# EAGLE schematic EtherMega (EAGLE 5.10)
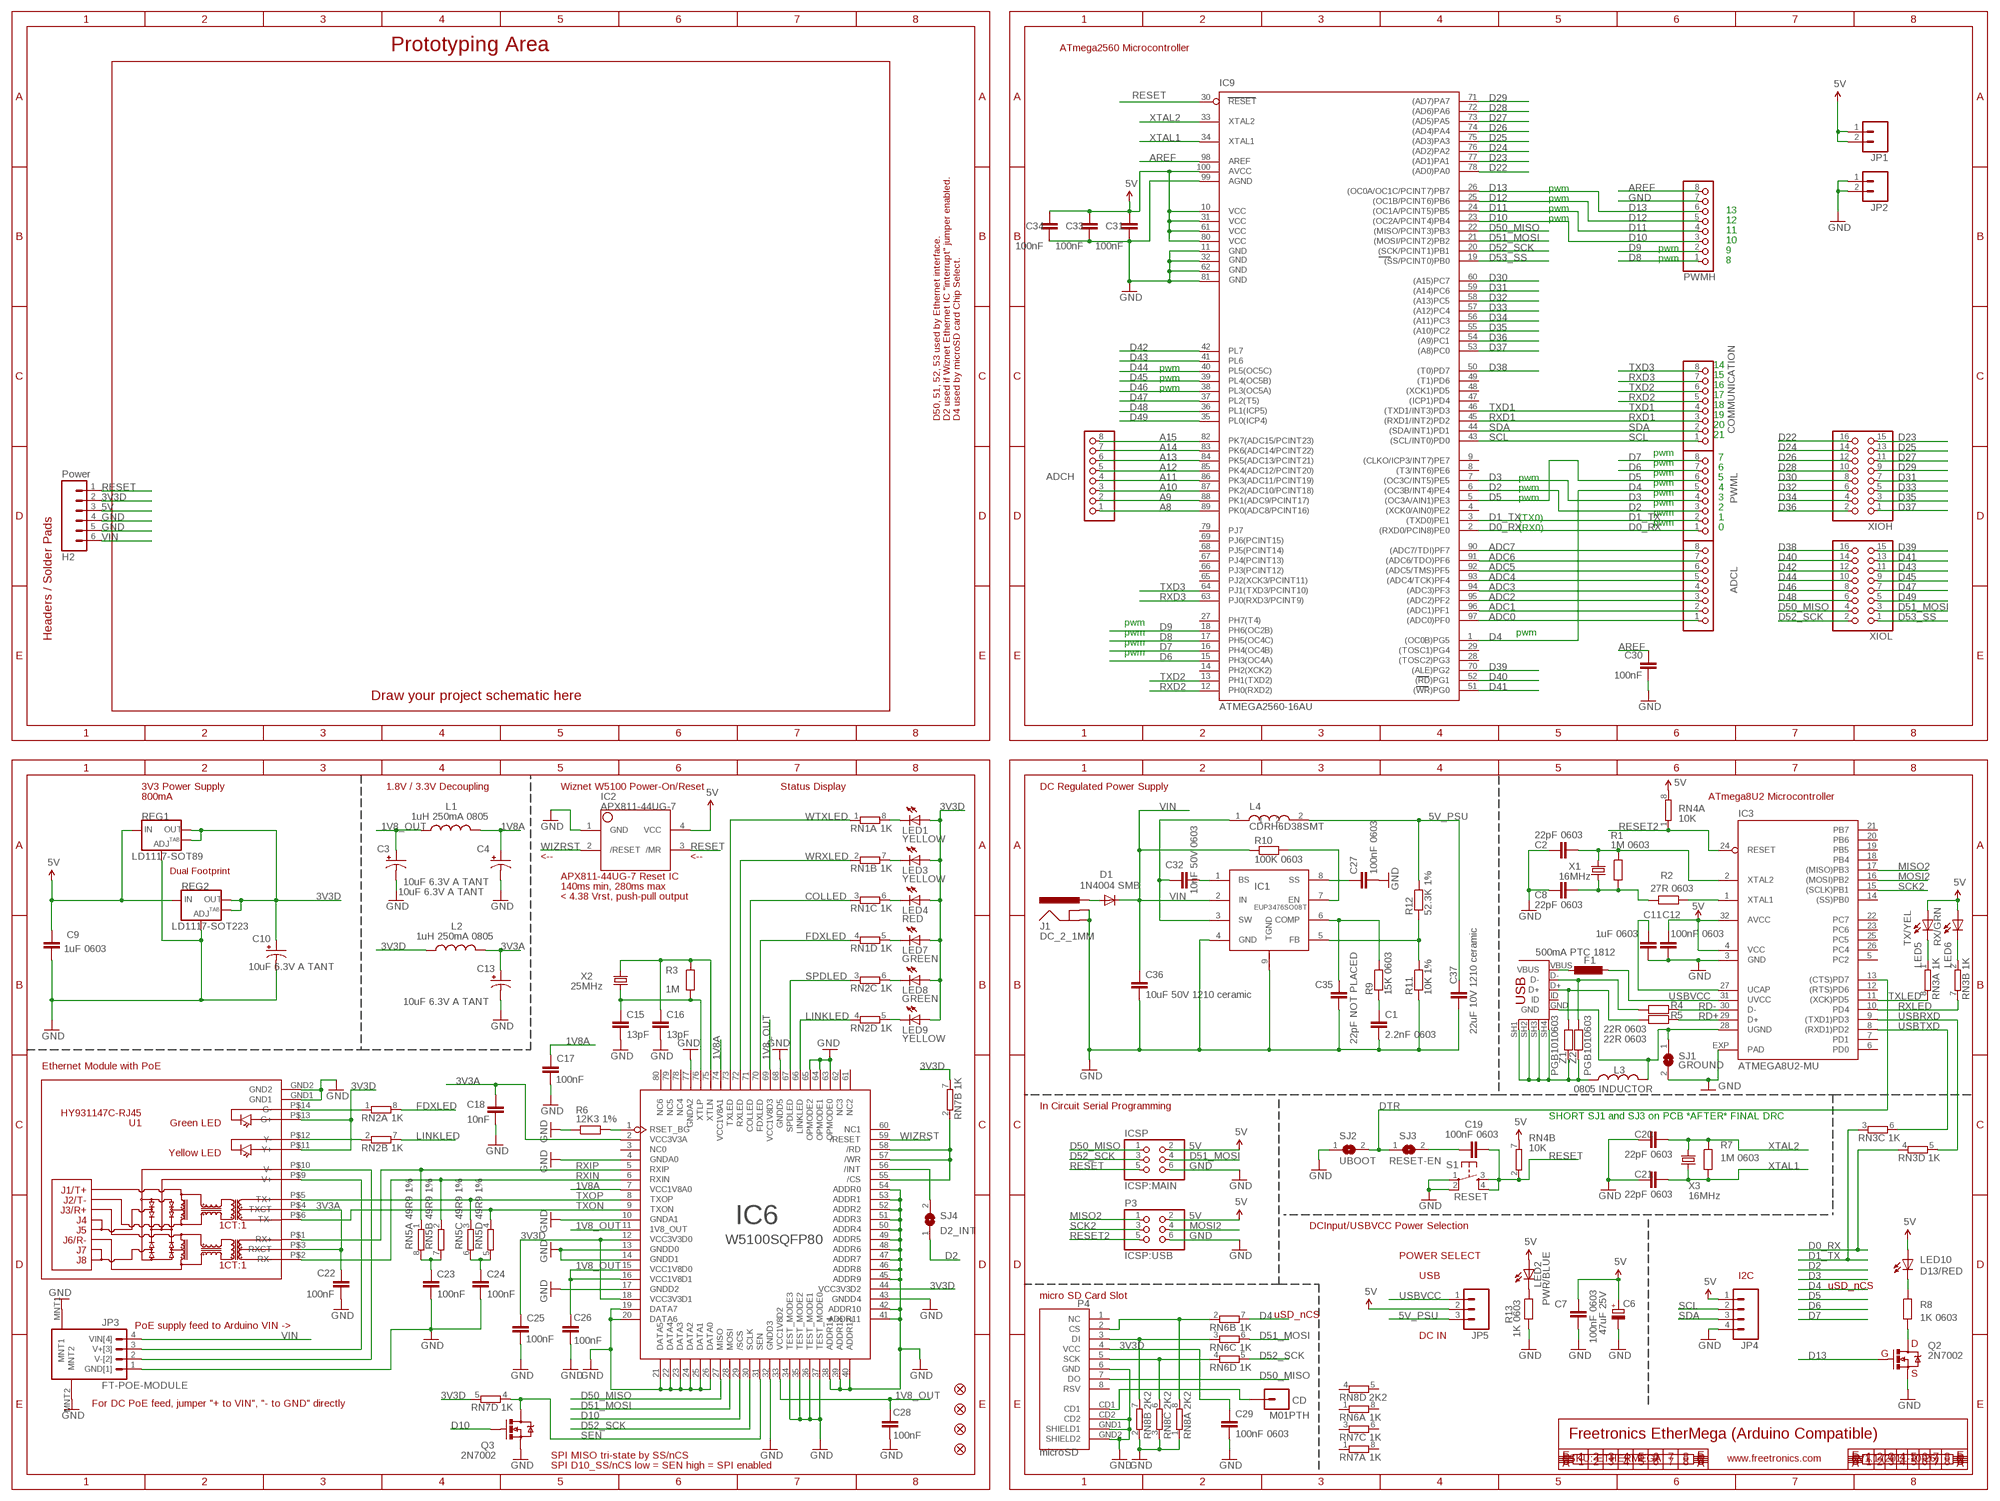
[diagram p0: schematic, sheet 1]

## Parts
ADCH  PINHD-1X8  [1X08]
ADCL  PINHD-1X8  [1X08]
C1  2.2nF 0603  CAP0603  [0603]
C2  22pF 0603  CAP0603  [0603]
C3  10uF 6.3V A TANT  CAP_POL1206  [EIA3216]
C4  10uF 6.3V A TANT  CAP_POL1206  [EIA3216]
C6  47uF 25V  CPOL-EUD  [PANASONIC_D]
C7  100nF 0603  CAP0603  [0603]
C8  22pF 0603  CAP0603  [0603]
C9  1uF 0603  CAP0603  [0603]
C10  10uF 6.3V A TANT  CAP_POL1206  [EIA3216]
C11  1uF 0603  CAP0603  [0603]
C12  100nF 0603  CAP0603  [0603]
C13  10uF 6.3V A TANT  CAP_POL1206  [EIA3216]
C15  13pF  CAP0603  [0603]
C16  13pF  CAP0603  [0603]
C17  100nF  CAP0603  [0603]
C18  10nF  CAP0603  [0603]
C19  100nF 0603  CAP0603  [0603]
C20  22pF 0603  CAP0603  [0603]
C21  22pF 0603  CAP0603  [0603]
C22  100nF  CAP0603  [0603]
C23  100nF  CAP0603  [0603]
C24  100nF  CAP0603  [0603]
C25  100nF  CAP0603  [0603]
C26  100nF  CAP0603  [0603]
C27  100nF 0603  CAP0603  [0603]
C28  100nF  CAP0603  [0603]
C29  100nF 0603  CAP0603  [0603]
C30  100nF  CAP0603  [0603]
C31  100nF  CAP0603  [0603]
C32  10nF 50V 0603  CAP0603  [0603]
C33  100nF  CAP0603  [0603]
C34  100nF  CAP0603  [0603]
C35  22pF NOT PLACED  CAP0603  [0603]
C36  10uF 50V 1210 ceramic  C-EUC1210  [C1210]
C37  22uF 10V 1210 ceramic  C-EUC1210  [C1210]
CD  M01PTH  [1X01]
COMMUNICATION  PINHD-1X8  [1X08]
D1  1N4004 SMB  DIODESMB  [SMB-DIODE]
F1  500mA PTC 1812  L-EUL1812  [L1812]
FID1  FIDUCIAL1X2.5  [FIDUCIAL-1X2.5]
FID2  FIDUCIAL1X2.5  [FIDUCIAL-1X2.5]
FID3  FIDUCIAL1X2.5  [FIDUCIAL-1X2.5]
FID4  FIDUCIAL1X2.5  [FIDUCIAL-1X2.5]
H2  Power  M06SIP  [1X06]
IC1  EUP3476SO08T  [SO08T]
IC2  APX811-44UG-7  APX81X-RESET-IC  [SOT143-R]
IC3  ATMEGA8U2-MU  ATMEL_ATMEGA8U2-MUQFN  [ATMEL_QFN32]
IC6  W5100SQFP80  [SQFP80]
IC9  ATMEGA2560-16AU  ATMEGA1280-16AU  [TQFP100]
ICSP  ICSP:MAIN  PINHD-2X3  [2X03]
J1  DC_2_1MM  POWER_JACKPTH  [POWER_JACK_PTH]
JP1  M02PTH  [1X02]
JP2  M02PTH  [1X02]
JP3  FT-POE-MODULE  FT-POE-MODULE2  [FT-POE-MODULE-CLEAN]
JP4  M04PTH  [1X04]
JP5  M03PTH  [1X03]
L1  1uH 250mA 0805  L-USL2012C  [L2012C]
L2  1uH 250mA 0805  L-USL2012C  [L2012C]
L3  0805 INDUCTOR  INDUCTOR0805-LARGE  [0805-LARGE]
L4  CDRH6D38SMT  [CDRH]
LED1  YELLOW  LED0603  [LED-0603]
LED2  PWR/BLUE  LED0603  [LED-0603]
LED3  YELLOW  LED0603  [LED-0603]
LED4  RED  LED0603  [LED-0603]
LED5  TX/YEL  LED0603  [LED-0603]
LED6  RX/GRN  LED0603  [LED-0603]
LED7  GREEN  LED0603  [LED-0603]
LED8  GREEN  LED0603  [LED-0603]
LED9  YELLOW  LED0603  [LED-0603]
LED10  D13/RED  LED0603  [LED-0603]
P1  USB-FT  [USB-MINIB-FT]
P3  ICSP:USB  PINHD-2X3  [2X03]
P4  microSD  USD-SOCKETNEW  [MICRO-SD-SOCKET-PP]
PWMH  PINHD-1X8  [1X08]
PWML  PINHD-1X8  [1X08]
Q2  2N7002  MOSFET-NCHANNELSMD  [SOT23-3]
Q3  2N7002  MOSFET-NCHANNELSMD  [SOT23-3]
R1  1M 0603  RESISTOR0603  [0603]
R2  27R 0603  RESISTOR0603  [0603]
R3  1M  RESISTOR0603  [0603]
R4  22R 0603  RESISTOR0603  [0603]
R5  22R 0603  RESISTOR0603  [0603]
R6  12K3 1%  RESISTOR0603  [0603]
R7  1M 0603  RESISTOR0603  [0603]
R8  1K 0603  RESISTOR0603  [0603]
R9  15K 0603  RESISTOR0603  [0603]
R10  100K 0603  RESISTOR0603  [0603]
R11  10K 1%  RESISTOR0603  [0603]
R12  52.3K 1%  RESISTOR0603  [0603]
R13  1K 0603  RESISTOR0603  [0603]
REG1  LD1117-SOT89  V_REG_LM1117SOT89  [SOT89]
REG2  LD1117-SOT223  V_REG_LM1117SOT223  [SOT223]
RN1  1K  4R-NCAY16  [CAY16]
RN2  1K  4R-NCAY16  [CAY16]
RN3  1K  4R-NCAY16  [CAY16]
RN4  10K  4R-NCAY16  [CAY16]
RN5  49R9 1%  4R-NCAY16  [CAY16]
RN6  1K  4R-NCAY16  [CAY16]
RN7  1K  4R-NCAY16  [CAY16]
RN8  2K2  4R-NCAY16  [CAY16]
S1  RESET  TAC_SWITCHSMD  [TACTILE_SWITCH_SMD]
SJ1  GROUND  SJ  [SJ]
SJ2  UBOOT  SJ  [SJ]
SJ3  RESET-EN  SJ  [SJ]
SJ4  D2_INT  SJ  [SJ]
U1  HY931147C-RJ45  [HY931147C]
X1  16MHz  CRYSTALHC49UV  [HC49U-V]
X2  25MHz  CRYSTALHC49UV  [HC49U-V]
X3  16MHz  CRYSTALHC49UV  [HC49U-V]
XIOH  PINHD-2X8  [2X08]
XIOL  PINHD-2X8  [2X08]
Z1  PGB1010603  RESISTOR0603  [0603]
Z2  PGB1010603  RESISTOR0603  [0603]

## Nets
1V8_OUT: C3.A(+) C26.1 C28.1 IC6.11(1V8_OUT) IC6.15(VCC1V8D0) IC6.16(VCC1V8D1) IC6.33(VCC1V8D2) IC6.69(VCC1V8D3) L1.1
1V8A: C4.A(+) C17.1 IC6.7(VCC1V8A0) IC6.74(VCC1V8A1) L1.2
3V3A: C13.A(+) C18.1 C22.1 IC6.2(VCC3V3A) L2.2 U1.P$3(RXCT) U1.P$4(TXCT)
3V3D: C10.A(+) C25.1 C29.1 H2.2 IC6.12(VCC3V3D0) IC6.18(VCC3V3D1) IC6.44(VCC3V3D2) L2.1 LED1.A LED3.A LED4.A LED7.A LED8.A LED9.A P4.4(VCC) REG1.2(OUT) REG1.4(OUT) REG2.2(OUT) REG2.4(OUT) RN7.5 RN7.7 U1.P$11(Y+) U1.P$13(G+)
5V [power]: C6.+ C7.1 C9.1 C12.1 C31.1 C33.1 C34.1 H2.3 IC2.4(VCC) IC3.4(VCC) IC3.32(AVCC) IC9.10(VCC) IC9.31(VCC1) IC9.61(VCC2) IC9.80(VCC3) IC9.100(AVCC) ICSP.2 JP1.1 JP1.2 JP4.1 JP5.2 LED2.A LED5.A LED6.A LED10.A P3.2 REG1.3(IN) REG2.3(IN) RN4.7 RN4.8
5V_PSU [power]: C37.1 JP5.3 L4.2 R12.2
A8: ADCH.1 IC9.89(PK0(ADC8/PCINT16))
A9: ADCH.2 IC9.88(PK1(ADC9/PCINT17))
A10: ADCH.3 IC9.87(PK2(ADC10/PCINT18))
A11: ADCH.4 IC9.86(PK3(ADC11/PCINT19))
A12: ADCH.5 IC9.85(PK4(ADC12/PCINT20))
A13: ADCH.6 IC9.84(PK5(ADC13/PCINT21))
A14: ADCH.7 IC9.83(PK6(ADC14/PCINT22))
A15: ADCH.8 IC9.82(PK7(ADC15/PCINT23))
ADC0: ADCL.1 IC9.97((ADC0)PF0)
ADC1: ADCL.2 IC9.96((ADC1)PF1)
ADC2: ADCL.3 IC9.95((ADC2)PF2)
ADC3: ADCL.4 IC9.94((ADC3)PF3)
ADC4: ADCL.5 IC9.93((ADC4/TCK)PF4)
ADC5: ADCL.6 IC9.92((ADC5/TMS)PF5)
ADC6: ADCL.7 IC9.91((ADC6/TDO)PF6)
ADC7: ADCL.8 IC9.90((ADC7/TDI)PF7)
AREF: C30.1 IC9.98(AREF) PWMH.8
COLLED: IC6.71(COLLED) RN1.3
D0_RX: IC9.2((RXD0/PCIN8)PE0) PWML.1 RN3.4
D1_TX: IC9.3((TXD0)PE1) PWML.2 RN3.3
D2: IC9.6((OC3B/INT4)PE4) PWML.3 SJ4.1
D3: IC9.7((OC3C/INT5)PE5) PWML.4
D4: IC9.1((OC0B)PG5) PWML.5 RN6.7
D5: IC9.5((OC3A/AIN1)PE3) PWML.6
D6: IC9.15(PH3(OC4A)) PWML.7
D7: IC9.16(PH4(OC4B)) PWML.8
D8: IC9.17(PH5(OC4C)) PWMH.1
D9: IC9.18(PH6(OC2B)) PWMH.2
D10: IC6.29(/SCS) IC9.23((OC2A/PCINT4)PB4) PWMH.3 Q3.1(G)
D11: IC9.24((OC1A/PCINT5)PB5) PWMH.4
D12: IC9.25((OC1B/PCINT6)PB6) PWMH.5
D13: IC9.26((OC0A/OC1C/PCINT7)PB7) PWMH.6 Q2.1(G)
D22: IC9.78((AD0)PA0) XIOH.16
D23: IC9.77((AD1)PA1) XIOH.15
D24: IC9.76((AD2)PA2) XIOH.14
D25: IC9.75((AD3)PA3) XIOH.13
D26: IC9.74((AD4)PA4) XIOH.12
D27: IC9.73((AD5)PA5) XIOH.11
D28: IC9.72((AD6)PA6) XIOH.10
D29: IC9.71((AD7)PA7) XIOH.9
D30: IC9.60((A15)PC7) XIOH.8
D31: IC9.59((A14)PC6) XIOH.7
D32: IC9.58((A13)PC5) XIOH.6
D33: IC9.57((A12)PC4) XIOH.5
D34: IC9.56((A11)PC3) XIOH.4
D35: IC9.55((A10)PC2) XIOH.3
D36: IC9.54((A9)PC1) XIOH.2
D37: IC9.53((A8)PC0) XIOH.1
D38: IC9.50((T0)PD7) XIOL.16
D39: IC9.70((ALE)PG2) XIOL.15
D40: IC9.52((RD)PG1) XIOL.14
D41: IC9.51((WR)PG0) XIOL.13
D42: IC9.42(PL7) XIOL.12
D43: IC9.41(PL6) XIOL.11
D44: IC9.40(PL5(OC5C)) XIOL.10
D45: IC9.39(PL4(OC5B)) XIOL.9
D46: IC9.38(PL3(OC5A)) XIOL.8
D47: IC9.37(PL2(T5)) XIOL.7
D48: IC9.36(PL1(ICP5)) XIOL.6
D49: IC9.35(PL0(ICP4)) XIOL.5
D50_MISO: IC6.27(MISO) IC9.22((MISO/PCINT3)PB3) ICSP.1 P4.7(DO) XIOL.4
D51_MOSI: IC6.28(MOSI) IC9.21((MOSI/PCINT2)PB2) ICSP.4 RN6.6 XIOL.3
D52_SCK: IC6.30(SCLK) IC9.20((SCK/PCINT1)PB1) ICSP.3 RN6.5 XIOL.2
D53_SS: IC9.19((SS/PCINT0)PB0) XIOL.1
DTR: IC3.13((CTS)PD7) SJ2.2 SJ3.1
FDXLED: IC6.70(FDXLED) RN1.4 RN2.8
GND: C1.2 C2.1 C3.C(-) C4.C(-) C6.- C7.2 C8.1 C9.2 C10.C(-) C11.2 C12.2 C13.C(-) C15.2 C16.2 C17.2 C18.2 C20.1 C21.1 C22.2 C23.2 C24.2 C25.2 C26.2 C27.2 C28.2 C29.2 C30.2 C31.2 C33.2 C34.2 C35.2 C36.2 C37.2 H2.4 H2.5 IC1.4(GND) IC1.9(TGND) IC2.1(GND) IC3.3(GND) IC3.EXP(PAD) IC6.4(GNDA0) IC6.10(GNDA1) IC6.13(GNDD0) IC6.14(GNDD1) IC6.17(GNDD2) IC6.19(DATA7) IC6.20(DATA6) IC6.21(DATA5) IC6.22(DATA4) IC6.23(DATA3) IC6.24(DATA2) IC6.25(DATA1) IC6.26(DATA0) IC6.32(GNDD3) IC6.34(TEST_MODE3) IC6.35(TEST_MODE2) IC6.36(TEST_MODE1) IC6.37(TEST_MODE0) IC6.38(ADDR14) IC6.39(ADDR13) IC6.40(ADDR12) IC6.41(ADDR11) IC6.42(ADDR10) IC6.43(GNDD4) IC6.45(ADDR9) IC6.46(ADDR8) IC6.47(ADDR7) IC6.48(ADDR6) IC6.49(ADDR5) IC6.50(ADDR4) IC6.51(ADDR3) IC6.52(ADDR2) IC6.53(ADDR1) IC6.54(ADDR0) IC6.63(OPMODE0) IC6.64(OPMODE1) IC6.65(OPMODE2) IC6.68(GNDD5) IC6.77(GNDA2) IC9.11(GND) IC9.32(GND1) IC9.62(GND2) IC9.81(GND3) IC9.99(AGND) ICSP.6 J1.GND J1.GNDBREAK JP2.1 JP2.2 JP3.1(GND[1]) JP3.MNT1 JP3.MNT2 JP4.4 P3.6 P4.6(GND) P4.CD2 P4.GND1(SHIELD1) P4.GND2(SHIELD2) PWMH.7 Q2.2(S) Q3.2(S) R6.1 R11.1 R13.1 REG1.1(ADJ) REG2.1(ADJ) RN8.1 RN8.2 RN8.3 S1.1 S1.2 SJ1.2 SJ2.1 U1.GND1 U1.GND2
LINKLED: IC6.66(LINKLED) RN2.4 RN2.7
MISO2: IC3.17((MISO)PB3) P3.1
MOSI2: IC3.16((MOSI)PB2) P3.4
N$1: C24.1 RN5.5 RN5.6
N$4: LED10.C R8.2
N$6: Q2.3(D) R8.1
N$8: IC3.1(XTAL1) R2.1
N$9: L3.1 P1.SH1(SH$1) P1.SH2(SH$2) P1.SH3(SH$3) P1.SH4(SH$4) Z1.2 Z2.2
N$11: LED6.C RN3.2
N$12: LED2.C R13.2
N$13: LED5.C RN3.1
N$16: P1.D+ R5.2 Z1.1
N$17: P1.D- R4.2 Z2.1
N$20: P4.5(SCK) RN6.4 RN8.6
N$23: CD.1 P4.CD1
N$24: P4.2(CS) RN6.2 RN8.8
N$25: P4.3(DI) RN6.3 RN8.7
N$26: LED8.C RN2.6
N$27: IC6.55(/CS) IC6.57(/WR) IC6.58(/RD) RN7.2
N$28: LED9.C RN2.5
N$60: D1.A J1.PWR
N$62: IC6.56(/INT) SJ4.2
N$64: C27.1 IC1.8(SS)
N$65: C1.1 R9.1
N$66: C35.1 IC1.6(COMP) R9.2
N$67: RN2.1 U1.P$14(G-)
N$68: JP3.3(V+[3]) U1.P$9(V+)
N$69: JP3.2(V-[2]) U1.P$10(V-)
N$70: C32.1 IC1.3(SW) L4.1
N$71: C32.2 IC1.1(BS)
N$72: IC1.7(EN) R10.2
N$74: IC3.28(UGND) L3.2 P1.GND SJ1.1
N$75: C19.1 SJ3.2
N$77: IC1.5(FB) R11.2 R12.1
N$113: C2.2 IC3.2(XTAL2) R1.2 X1.2
N$114: C8.2 R1.1 R2.2 X1.1
N$115: F1.1 P1.VBUS
N$117: C11.1 IC3.27(UCAP)
N$321: C23.1 RN5.7 RN5.8
N$322: IC6.1(RSET_BG) R6.2
N$327: LED7.C RN1.5
N$328: LED4.C RN1.6
N$329: LED3.C RN1.7
N$330: LED1.C RN1.8
N$332: RN2.2 U1.P$12(Y-)
RD+: IC3.29(D+) R5.1
RD-: IC3.30(D-) R4.1
RESET: C19.2 H2.1 IC2.3(/MR) IC9.30(RESET) ICSP.5 RN4.2 S1.3 S1.4
RESET2: IC3.24(RESET) P3.5 RN4.1
RXD1: COMMUNICATION.3 IC9.45((RXD1/INT2)PD2)
RXD2: COMMUNICATION.5 IC9.12(PH0(RXD2))
RXD3: COMMUNICATION.7 IC9.63(PJ0(RXD3/PCINT9))
RXIN: IC6.6(RXIN) RN5.2 U1.P$2(RX-)
RXIP: IC6.5(RXIP) RN5.1 U1.P$1(RX+)
RXLED: IC3.10(PD4) RN3.7
SCK2: IC3.15((SCLK)PB1) P3.3
SCL: COMMUNICATION.1 IC9.43((SCL/INT0)PD0) JP4.2
SDA: COMMUNICATION.2 IC9.44((SDA/INT1)PD1) JP4.3
SEN: IC6.31(SEN) Q3.3(D) RN7.4
SPDLED: IC6.67(SPDLED) RN2.3
TXD1: COMMUNICATION.4 IC9.46((TXD1/INT3)PD3)
TXD2: COMMUNICATION.6 IC9.13(PH1(TXD2))
TXD3: COMMUNICATION.8 IC9.64(PJ1(TXD3/PCINT10))
TXLED: IC3.11((XCK)PD5) RN3.8
TXON: IC6.9(TXON) RN5.4 U1.P$6(TX-)
TXOP: IC6.8(TXOP) RN5.3 U1.P$5(TX+)
USBRXD: IC3.9((TXD1)PD3) RN3.5
USBTXD: IC3.8((RXD1)PD2) RN3.6
USBVCC: F1.2 IC3.31(UVCC) JP5.1
VIN: C36.1 D1.C H2.6 IC1.2(IN) JP3.4(VIN[4]) R10.1
WIZRST: IC2.2(/RESET) IC6.59(/RESET)
WRXLED: IC6.72(RXLED) RN1.2
WTXLED: IC6.73(TXLED) RN1.1
XTAL1: C21.2 IC9.34(XTAL1) R7.1 X3.1
XTAL2: C20.2 IC9.33(XTAL2) R7.2 X3.2
XTLN: C16.1 IC6.75(XTLN) R3.2 X2.2
XTLP: C15.1 IC6.76(XTLP) R3.1 X2.1
Unconnected: IC3.5(PC2) IC3.6(PD0) IC3.7(PD1) IC3.12((RTS)PD6) IC3.14((SS)PB0) IC3.18(PB4) IC3.19(PB5) IC3.20(PB6) IC3.21(PB7) IC3.22(PC7) IC3.23(PC6) IC3.25(PC5) IC3.26(PC4) IC6.3(NC0) IC6.60(NC1) IC6.61(NC2) IC6.62(NC3) IC6.78(NC4) IC6.79(NC5) IC6.80(NC6) IC9.4((XCK0/AIN0)PE2) IC9.8((T3/INT6)PE6) IC9.9((CLKO/ICP3/INT7)PE7) IC9.14(PH2(XCK2)) IC9.27(PH7(T4)) IC9.28((TOSC2)PG3) IC9.29((TOSC1)PG4) IC9.47((ICP1)PD4) IC9.48((XCK1)PD5) IC9.49((T1)PD6) IC9.65(PJ2(XCK3/PCINT11)) IC9.66(PJ3(PCINT12)) IC9.67(PJ4(PCINT13)) IC9.68(PJ5(PCINT14)) IC9.69(PJ6(PCINT15)) IC9.79(PJ7) P1.ID P4.1(NC) P4.8(RSV) RN4.3 RN4.4 RN4.5 RN4.6 RN6.1 RN6.8 RN7.1 RN7.3 RN7.6 RN7.8 RN8.4 RN8.5

## Notes on the sheet
- Prototyping Area | ATmega2560 Microcontroller
- pwm
- pwm
- pwm | 13
- pwm | 12
- 11
- 10
- pwm | 9
- pwm | 8
- pwm | 14
- pwm | 15
- pwm | 16
- 17
- 18
- D50, 51, 52, 53 used by Ethernet interface. | D2 used if Wiznet Ethernet IC "interrupt" jumper enabled. | D4 used by microSD card Chip Select. | 19
- 20
- 21
- pwm
- 7
- pwm
- 6
- pwm
- pwm | 5
- pwm
- pwm | 4
- pwm
- pwm | 3
- pwm
- 2
- pwm
- (TX0) | 1
- pwm
- (RX0) | 0
- pwm
- pwm | pwm
- Headers / Solder Pads
- pwm
- pwm
- Draw your project schematic here
- 3V3 Power Supply | 1.8V / 3.3V Decoupling | Wiznet W5100 Power-On/Reset | Status Display | DC Regulated Power Supply
- 800mA | ATmega8U2 Microcontroller
- <-- | <--
- Dual Footprint
- APX811-44UG-7 Reset IC
- 140ms min, 280ms max
- < 4.38 Vrst, push-pull output
- Ethernet Module with PoE
- In Circuit Serial Programming
- SHORT SJ1 and SJ3 on PCB *AFTER* FINAL DRC
- DCInput/USBVCC Power Selection
- POWER SELECT
- USB | I2C
- uSD_nCS
- micro SD Card Slot
- uSD_nCS
- PoE supply feed to Arduino VIN ->
- DC IN
- D
- G
- S
- For DC PoE feed, jumper "+ to VIN", "- to GND" directly
- Freetronics EtherMega (Arduino Compatible)
- SPI MISO tri-state by SS/nCS
- SKU: ETHERMEGA | www.freetronics.com | V1.1 (2011-10-26)
- SPI D10_SS/nCS low = SEN high = SPI enabled

## Library data of the parts
ADCH ADCL COMMUNICATION PWMH PWML = pinhead:PINHD-1X8: PIN HEADER
C1 C2 C7-C9 C12 C15-C35 = freetronics-marc:CAP: Capacitor Standard 0603 ceramic capacitor, and 0.1" leaded capacitor.
C3 C4 C10 C13 = freetronics:CAP_POL: Capacitor Polarized These are standard SMD and PTH capacitors. Normally 10uF, 47uF, and 100uF in electrolytic and tantalum varieties. Always verify the external diameter of the through hole cap, it varies with capacity, voltage, and manufacturer. The EIA devices should be standard.
C6 = rcl:CPOL-EU: POLARIZED CAPACITOR, European symbol
C11 = freetronics-master-v1:CAP: Capacitor Standard 0603 ceramic capacitor, and 0.1" leaded capacitor.
C36 C37 = freetronics-jon:C-EU: CAPACITOR, European symbol
CD = freetronics-2:M01: Header 1 Standard 1-pin 0.1" header. Use with straight break away headers (SKU : PRT-00116), right angle break away headers (PRT-00553), swiss pins (PRT-00743), machine pins (PRT-00117), and female headers (PRT-00115).
D1 = freetronics:DIODE: Diode These are standard reverse protection diodes and small signal diodes. SMA package can handle up to about 1A. SOD-323 can handle about 200mA. What the SOD-323 package when ordering, there are some mfgs out there that are 5-pin packages.
F1 = rcl:L-EU: INDUCTOR, European symbol
FID1-FID4 = freetronics:FIDUCIAL: Fiducial Alignment Points Various fiducial points for machine vision alignment.
H2 = freetronics:M06: Header 6 Standard 6-pin 0.1" header. Use with straight break away headers (SKU : PRT-00116), right angle break away headers (PRT-00553), swiss pins (PRT-00743), machine pins (PRT-00117), and female headers (PRT-00115). Molex polarized connector foot print use with SKU : PRT-08094 with associated crimp pins and housings. NOTES ON THE VARIANTS LOCK and LOCK_LONGPADS... This footprint was designed to help hold the alignment of a through-hole component (i.e. 6-pin header) while soldering it into place. You may notice that each hole has been shifted either up or down by 0.005 of an inch from it's more standard position (which is a perfectly straight line). This slight alteration caused the pins (the squares in the middle) to touch the edges of the holes. Because they are alternating, it causes a "brace" to hold the component in place. 0.005 has proven to be the perfect amount of "off-center" position when using our standard breakaway headers. Although looks a little odd when you look at the bare footprint, once you have a header in there, the alteration is very hard to notice. Also, if you push a header all the way into place, it is covered up entirely on the bottom side. This idea of altering the position of holes to aid alignment will be further integrated into the Sparkfun Library for other footprints. It can help hold any component with 3 or more connection pins.
IC1 = freetronics-jon:EUP3476
IC2 = freetronics-master-v1:APX81X-RESET-IC
IC3 = freetronics-jon:ATMEL_ATMEGA8U2-MU
IC6 = freetronics-marc:W5100: WIZnet W5100
IC9 = atmel-2005:ATMEGA*: MICROCONTROLLER 64/128/256 Kbytes FLASH 4 Kbytes EEPROM 8 Kbytes SRAM 86 General Purpose I/O pins 12-channels16-bit PWM 4 x Serial USARTs 16-channels 10-bit A/D
ICSP P3 = pinhead:PINHD-2X3: PIN HEADER
J1 = freetronics:POWER_JACK: Power Jack This is the standard 5.5mm barrel jack for power. The PTH is the most common, proven, reliable, footprint. All others are experimental. The Slot footprint only works if the mill layer is transmitted to the PCB fab house so be warned. Spark Fun Electronics SKU : PRT-00119. Mating wall wart : TOL-00298 (and others)
JP1 JP2 = freetronics-master-v1:M02: Header 2 Standard 2-pin 0.1" header. Use with straight break away headers (SKU : PRT-00116), right angle break away headers (PRT-00553), swiss pins (PRT-00743), machine pins (PRT-00117), and female headers (PRT-00115). Molex polarized connector foot print use with SKU : PRT-08233 with associated crimp pins and housings.
JP3 = freetronics-master-v1:FT-POE-MODULE
JP4 = freetronics-master-v1:M04: Header 4 Standard 4-pin 0.1" header. Use with straight break away headers (SKU : PRT-00116), right angle break away headers (PRT-00553), swiss pins (PRT-00743), machine pins (PRT-00117), and female headers (PRT-00115). Molex polarized connector foot print use with SKU : PRT-08231 with associated crimp pins and housings.
JP5 = freetronics-master-v1.1:M03: Header 3 Standard 3-pin 0.1" header. Use with straight break away headers (SKU : PRT-00116), right angle break away headers (PRT-00553), swiss pins (PRT-00743), machine pins (PRT-00117), and female headers (PRT-00115). Molex polarized connector foot print use with SKU : PRT-08232 with associated crimp pins and housings.
L1 L2 = rcl:L-US: INDUCTOR, American symbol
L3 = freetronics-master-v1:INDUCTOR: Inductors Basic Inductor/Choke - 0603 and 1206. Footprints are not proven and vary greatly between part numbers.
L4 = freetronics-jon:CDRH6D38: Inductor
LED1-LED10 = freetronics:LED: LEDs Standard schematic elements and footprints for 5mm, 3mm, 1206, and 0603 sized LEDs. 5mm - Spark Fun Electronics SKU : COM-00529 (and others)
P1 = freetronics-master-v1:USB-FT
P4 = freetronics-master-v1:USD-SOCKET: microSD Socket Push-push type uSD socket. Schematic element and footprint production proven. Spark Fun Electronics SKU : PRT-00127. tDoc lines correctly indicate media card edge positions when inserting (unlocked, locked, depressed).
Q2 Q3 = freetronics:MOSFET-NCHANNEL
R1-R8 R13 = freetronics-marc:RESISTOR: Resistor Basic schematic elements and footprints for 0603, 1206, and PTH 1/10th watt (small) resistors.
R9-R12 = freetronics-original:RESISTOR: Resistor Basic schematic elements and footprints for 0603, 1206, and PTH 1/10th watt (small) resistors.
REG1 REG2 = freetronics:V_REG_LM1117: Voltage Regulator LD1117 Adjustable low-dropout voltage regulator available in SOT89 and SOT223 SMT packages.
RN1-RN8 = freetronics-master-v1:4R-N: Array Chip Resistor Source: RS Component / Phycomp
S1 = freetronics:TAC_SWITCH: Momentary Switch Button commonly used for reset or general input. Spark Fun Electronics SKU : COM-00097
SJ1-SJ4 = jumper:SJ: SMD solder JUMPER
U1 = freetronics-jon:HY931147C
X1-X3 = freetronics-master-v1:CRYSTAL: Crystals Various standard crystals. Proven footprints. Spark Fun Electronics SKU : COM-00534
XIOH XIOL = pinhead:PINHD-2X8: PIN HEADER
Z1 Z2 = freetronics:RESISTOR: Resistor Basic schematic elements and footprints for 0603, 1206, and PTH 1/10th watt (small) resistors.